# EasyEDA Pro project zdiy1.eprj, schematic Schematic1

## Sheets
1 P1: Board Name: Board1; Create Date: 2025-08-18; Page Name: P1; Project Name: zdiy1; Schematic Name: Schematic1; Update Date: 2025-09-12; Company: 嘉立创EDA; Page Size: A4; Version: V1.0
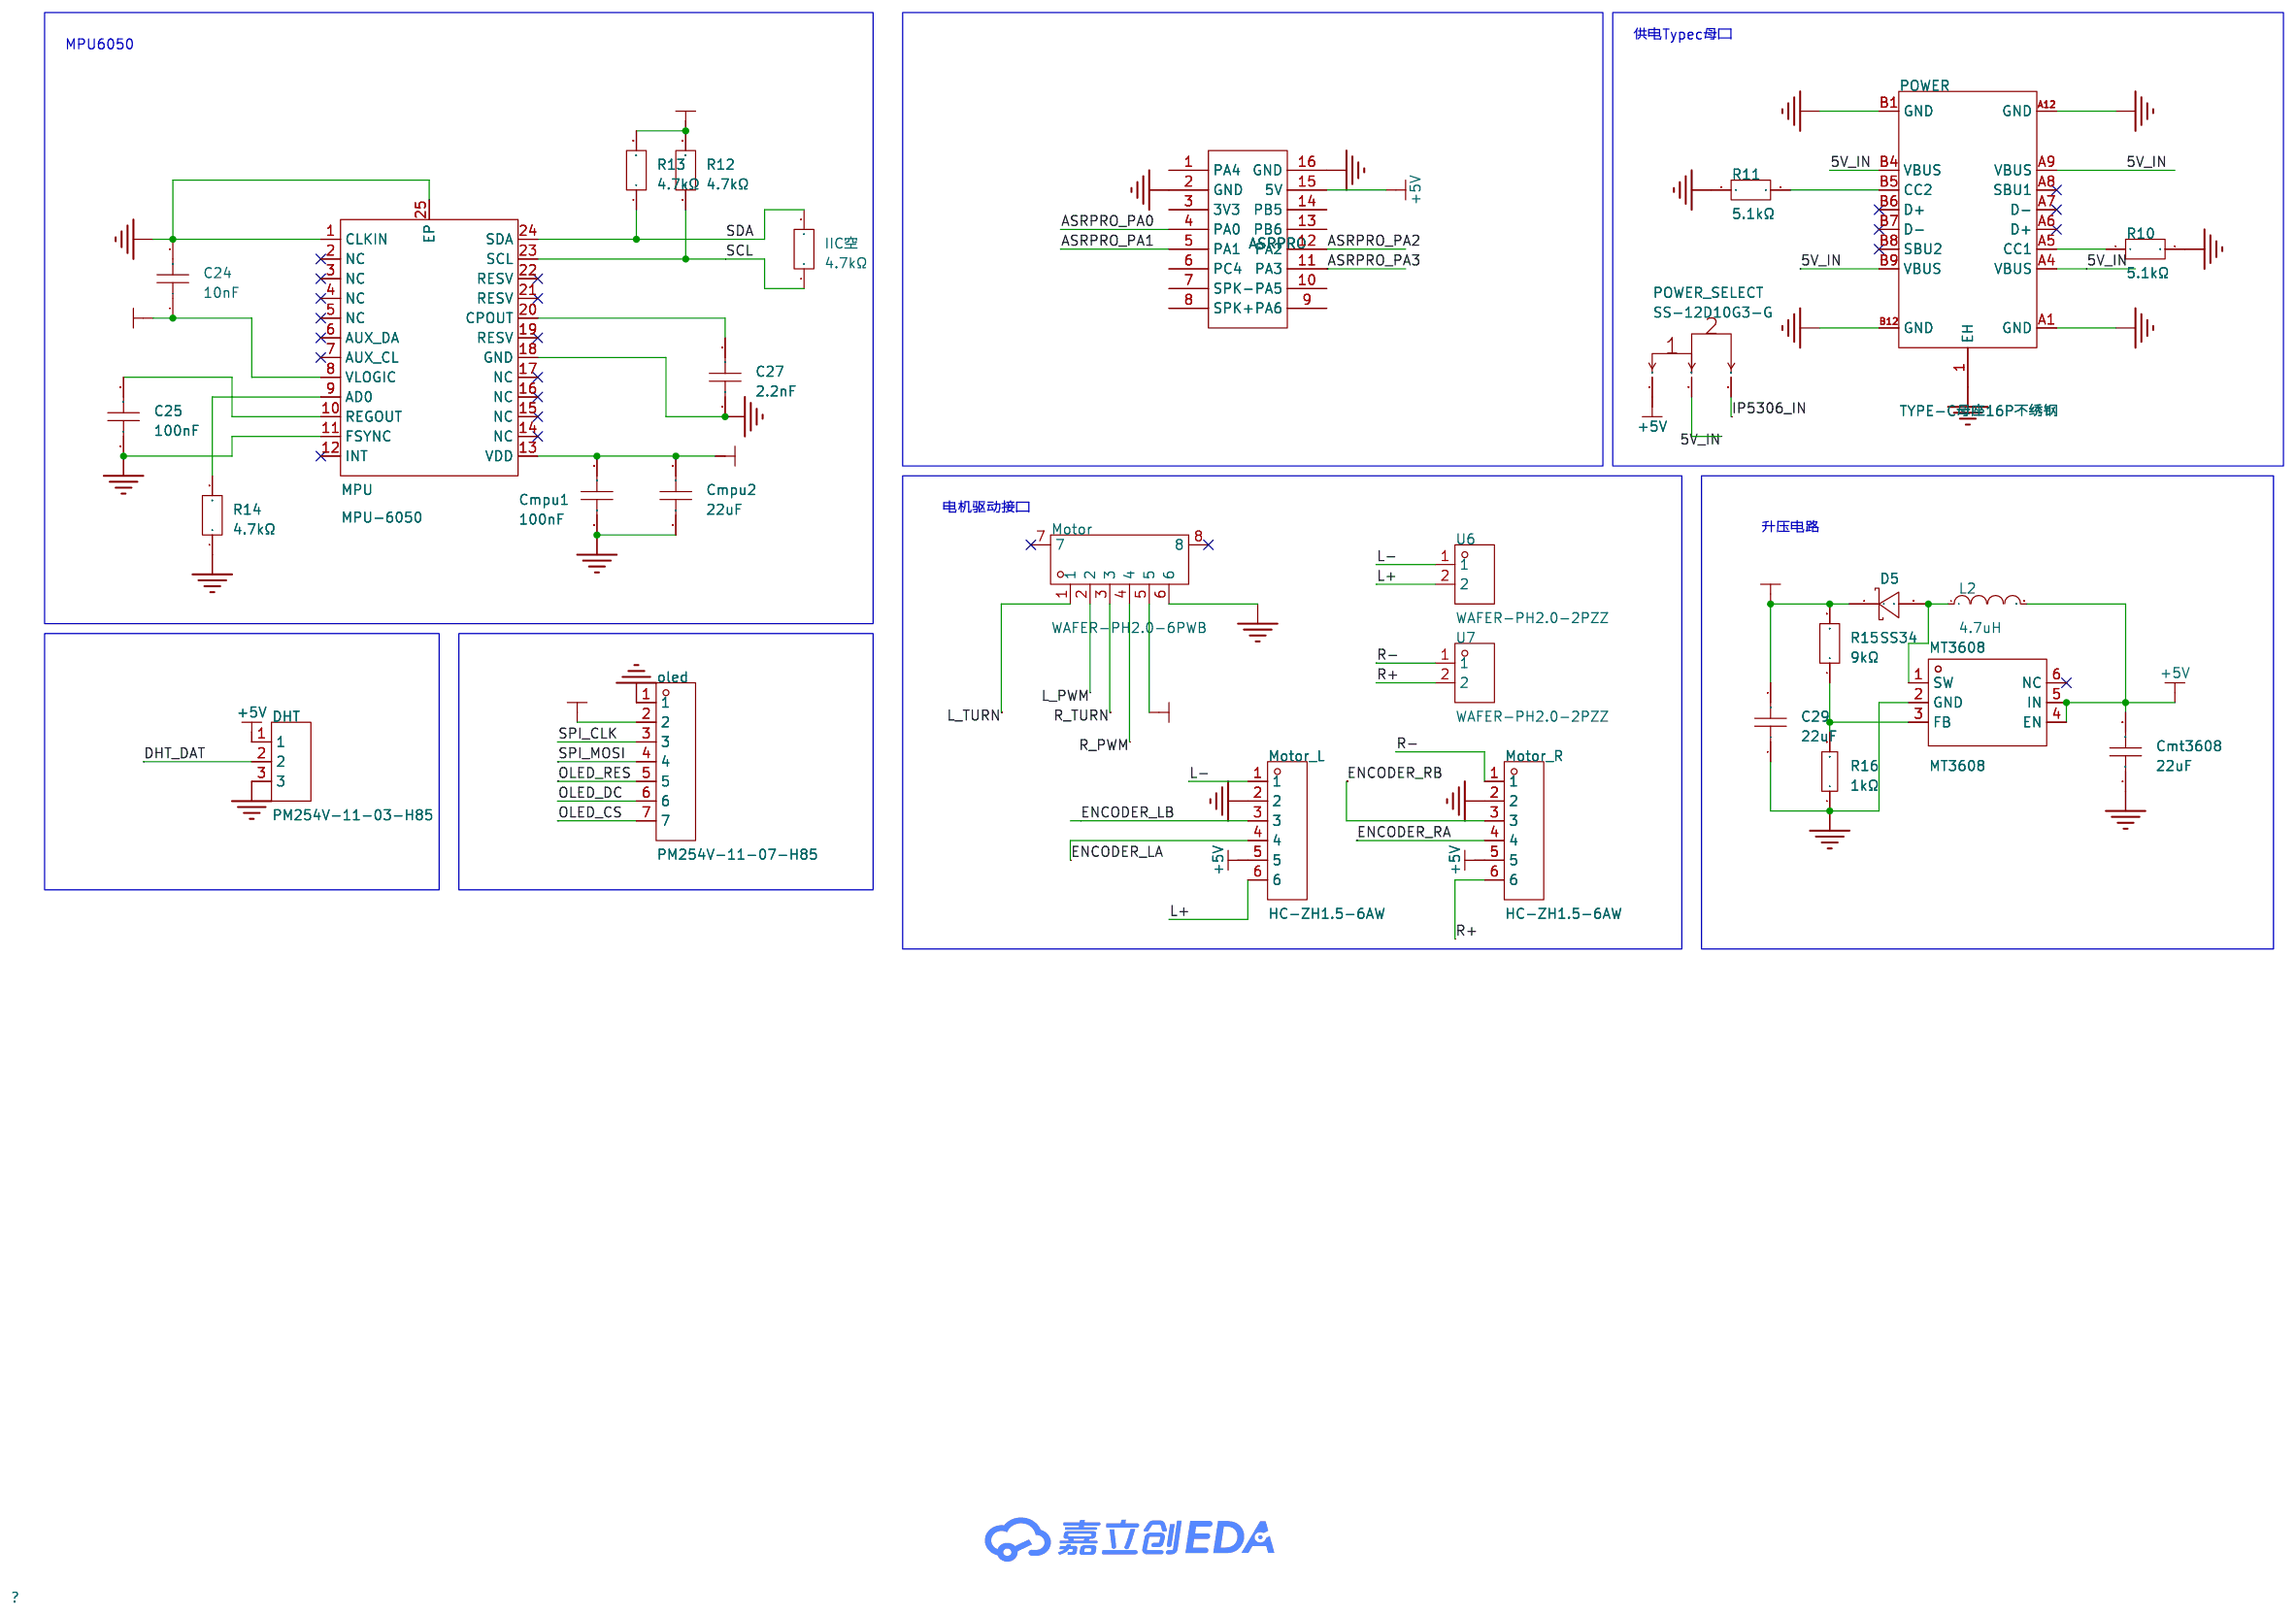
[diagram p0: P1]
2 P2: Create Date: 2025-08-19; Page Name: P2; Update Date: 2025-09-02
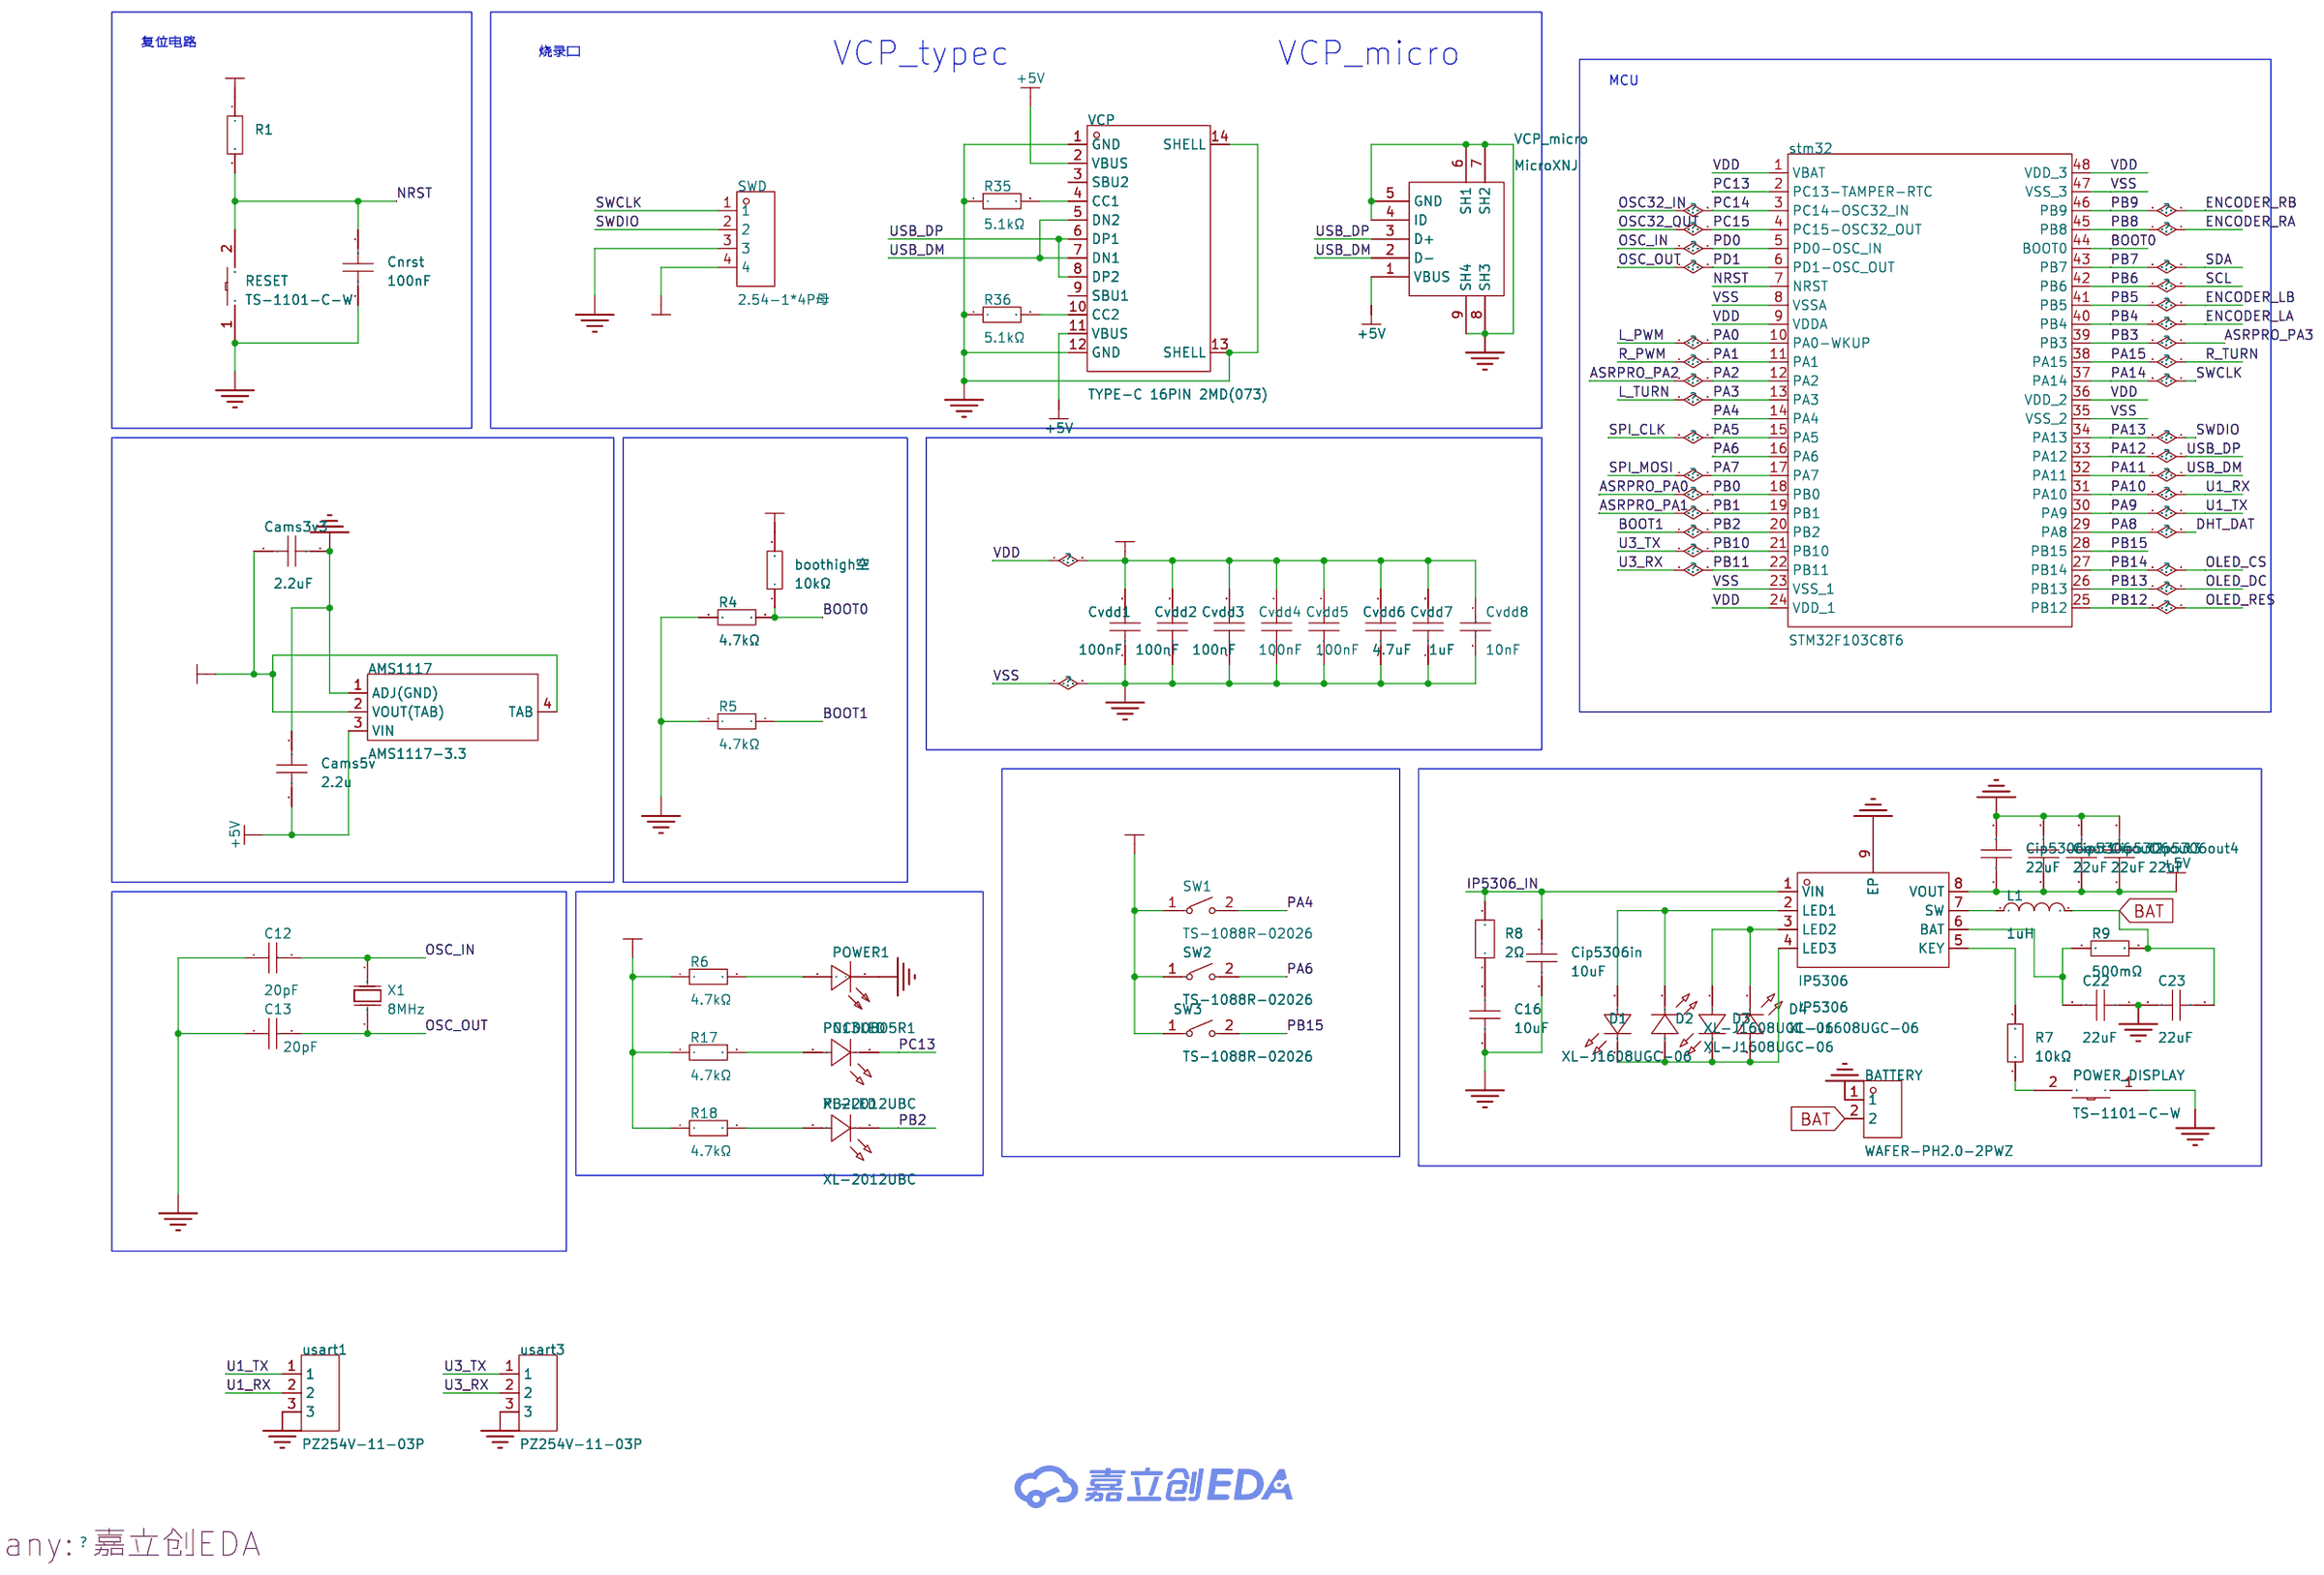
[diagram p1: P2]
3 P3: Create Date: 2025-08-30; Page Name: P3; Update Date: 2025-08-30
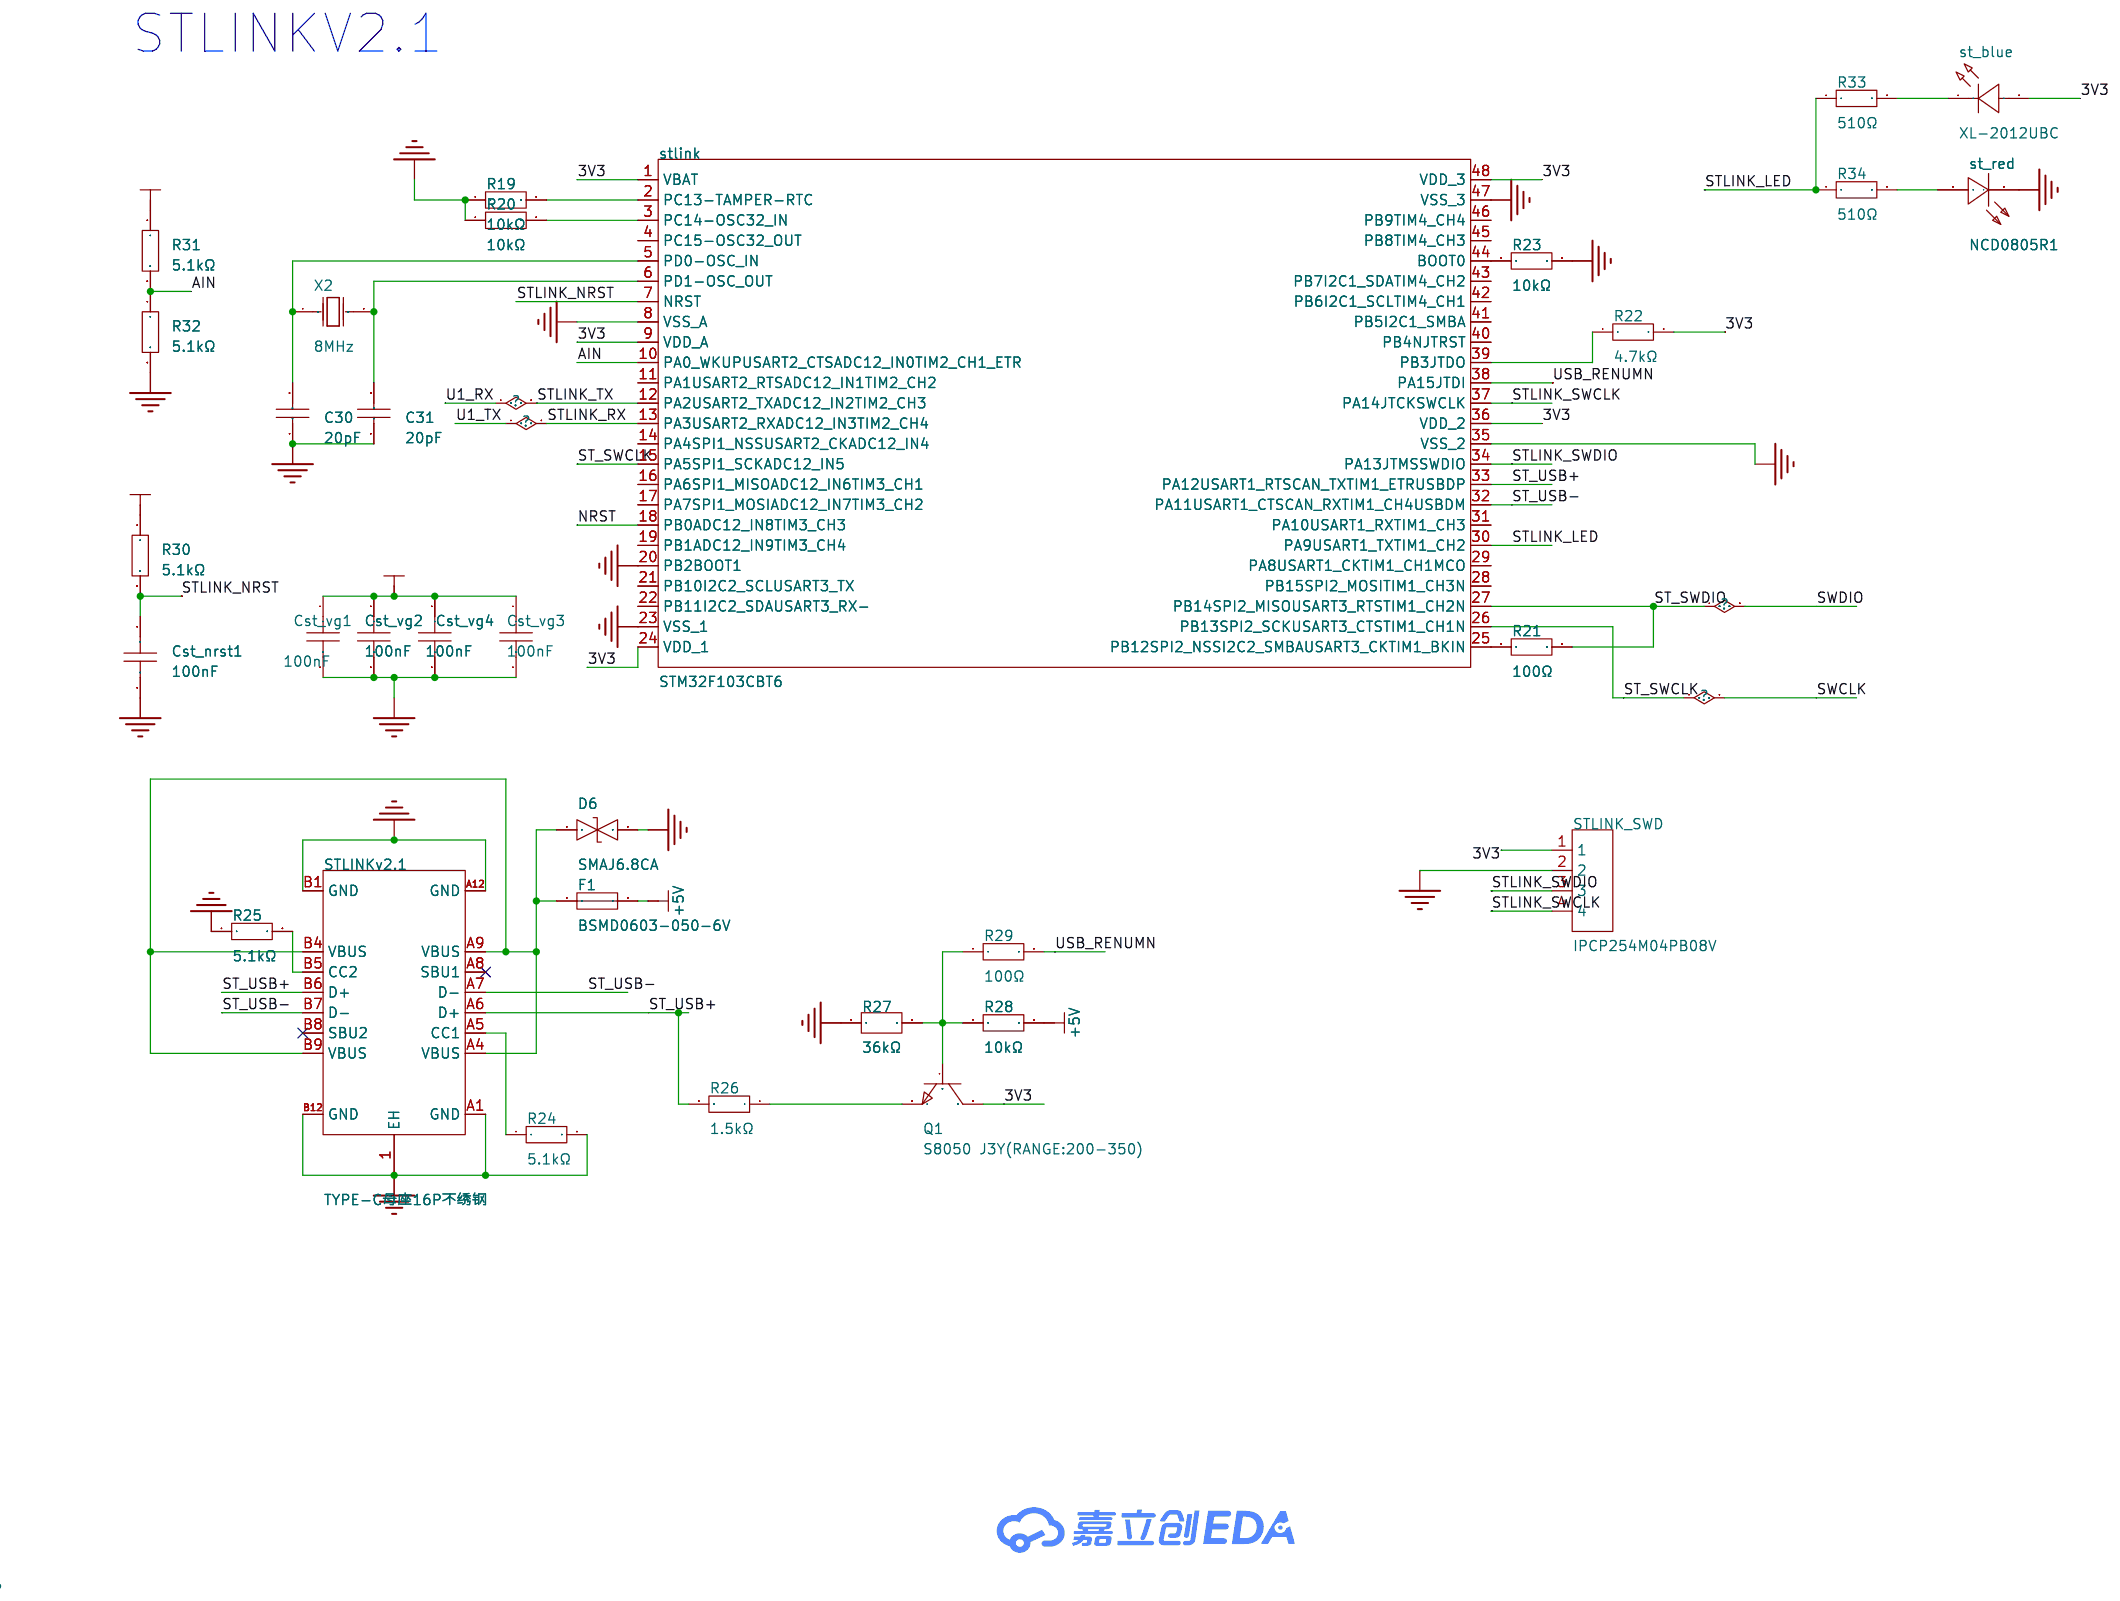
[diagram p2: P3]

## Parts
sheet P1
ASRPRO  ASRPRO  [asrpro_fz]
C24  10nF  [C0603]
C25  100nF  [C0603]
C27  2.2nF  [C0603]
C29  22uF  [C0603]
Cmpu1  100nF  [C0603]
Cmpu2  22uF  [C0603]
Cmt3608  22uF  [C0603]
D5  SS34  [SMA_L4.3-W2.6-LS5.2-RD]
DHT  PM254V-11-03-H85  [HDR-TH_3P-P2.54-V-F]
IIC空  4.7kΩ  [R0603]
L2  4.7uH  [IND-SMD_L5.4-W5.2_FXL0530]
Motor  WAFER-PH2.0-6PWB  [CONN-SMD_6P-P2.00_XUNPU_WAFER-PH2.0-6PWB]
Motor_L  HC-ZH1.5-6AW  [CONN-TH_6P-P1.50_HCTL_C-ZH1.5-6AW]
Motor_R  HC-ZH1.5-6AW  [CONN-TH_6P-P1.50_HCTL_C-ZH1.5-6AW]
MPU  MPU-6050  [QFN-24_L4.0-W4.0-P0.50-BL-EP2.7]
MT3608  MT3608  [SOT-23-6_L2.9-W1.6-P0.95-LS2.8-BL]
oled  PM254V-11-07-H85  [HDR-TH_7P-P2.54-V-F]
POWER  TYPE-C母座16P不绣钢  [TYPE-C-SMD_16P-EH4]
POWER_SELECT  SS-12D10G3-G  [SW-TH_3P-L12.7-W6.7-P4.80_SS-12D10G10-G]
R10  5.1kΩ  [R0603]
R11  5.1kΩ  [R0603]
R12  4.7kΩ  [R0603]
R13  4.7kΩ  [R0603]
R14  4.7kΩ  [R0603]
R15  9kΩ  [R0603]
R16  1kΩ  [R0603]
U6  WAFER-PH2.0-2PZZ  [CONN-TH_2P-P2.00_HC-PH-2A-M]
U7  WAFER-PH2.0-2PZZ  [CONN-TH_2P-P2.00_HC-PH-2A-M]
sheet P2
AMS1117  AMS1117-3.3  [SOT-223-4_L6.5-W3.5-P2.30-LS7.0-BR]
BATTERY  WAFER-PH2.0-2PWZ  [CONN-TH_2P-P2.00_GP01-2001WR-2P]
boothigh空  10kΩ  [R0603]
C12  20pF  [C0603]
C13  20pF  [C0603]
C16  10uF  [C0603]
C22  22uF  [C0603]
C23  22uF  [C0603]
Cams3v3  2.2uF  [C0603]
Cams5v  2.2u  [C0603]
Cip5306in  10uF  [C0603]
Cip5306out1  22uF  [C0603]
Cip5306out2  22uF  [C0603]
Cip5306out3  22uF  [C0603]
Cip5306out4  22uF  [C0603]
Cnrst  100nF  [C0603]
Cvdd1  100nF  [C0603]
Cvdd2  100nF  [C0603]
Cvdd3  100nF  [C0603]
Cvdd4  100nF  [C0603]
Cvdd5  100nF  [C0603]
Cvdd6  4.7uF  [C0603]
Cvdd7  1uF  [C0603]
Cvdd8  10nF  [C0603]
D1  XL-J1608UGC-06  [LED-SMD_XL-J1608UYC-06]
D2  XL-J1608UGC-06  [LED-SMD_XL-J1608UYC-06]
D3  XL-J1608UGC-06  [LED-SMD_XL-J1608UYC-06]
D4  XL-J1608UGC-06  [LED-SMD_XL-J1608UYC-06]
IP5306  IP5306  [ESOP-8_L4.9-W3.9-P1.27-LS6.0-BL-EP]
L1  1uH  [L0603]
PB2LED  XL-2012UBC  [LED0805-RD]
PC13LED  XL-2012UBC  [LED0805-RD]
POWER1  NCD0805R1  [LED0805-R-RD]
POWER_DISPLAY  TS-1101-C-W  [SW-SMD_L6.0-W3.3-LS8.0]
R1  5.1kΩ  [R0603]
R4  4.7kΩ  [R0603]
R5  4.7kΩ  [R0603]
R6  4.7kΩ  [R0603]
R7  10kΩ  [R0603]
R8  2Ω  [R0603]
R9  500mΩ  [R0603]
R17  4.7kΩ  [R0603]
R18  4.7kΩ  [R0603]
R35  5.1kΩ  [R0603]
R36  5.1kΩ  [R0603]
RESET  TS-1101-C-W  [SW-SMD_L6.0-W3.3-LS8.0]
stm32  STM32F103C8T6  [LQFP-48_L7.0-W7.0-P0.50-LS9.0-BL]
SW1  TS-1088R-02026  [SW-SMD_L3.9-W3.0-P4.45]
SW2  TS-1088R-02026  [SW-SMD_L3.9-W3.0-P4.45]
SW3  TS-1088R-02026  [SW-SMD_L3.9-W3.0-P4.45]
SWD  2.54-1*4P母  [HDR-TH_4P-P2.54-V-F]
usart1  PZ254V-11-03P  [HDR-TH_3P-P2.54-V-M]
usart3  PZ254V-11-03P  [HDR-TH_3P-P2.54-V-M]
VCP  TYPE-C 16PIN 2MD(073)  [USB-C-SMD_TYPE-C-6PIN-2MD-073]
VCP_micro  MicroXNJ  [MICRO-USB-SMD_MICROXNJ]
X1  8MHz  [OSC-TH_L10.0-W4.5-P5.00]
sheet P3
C30  20pF  [C0603]
C31  20pF  [C0603]
Cst_nrst1  100nF  [C0603]
Cst_vg1  100nF  [C0603]
Cst_vg2  100nF  [C0603]
Cst_vg3  100nF  [C0603]
Cst_vg4  100nF  [C0603]
D6  SMAJ6.8CA  [SMA_L4.4-W2.6-LS5.0-BI]
F1  BSMD0603-050-6V  [F0603]
Q1  S8050 J3Y(RANGE:200-350)  [SOT-23-3_L3.0-W1.7-P0.95-LS2.9-BR]
R19  10kΩ  [R0603]
R20  10kΩ  [R0603]
R21  100Ω  [R0603]
R22  4.7kΩ  [R0603]
R23  10kΩ  [R0603]
R24  5.1kΩ  [R0603]
R25  5.1kΩ  [R0603]
R26  1.5kΩ  [R0603]
R27  36kΩ  [R0603]
R28  10kΩ  [R0603]
R29  100Ω  [R0603]
R30  5.1kΩ  [R0603]
R31  5.1kΩ  [R0603]
R32  5.1kΩ  [R0603]
R33  510Ω  [R0603]
R34  510Ω  [R0603]
st_blue  XL-2012UBC  [LED0805-RD]
st_red  NCD0805R1  [LED0805-R-RD]
stlink  STM32F103CBT6  [LQFP-48_L7.0-W7.0-P0.50-LS9.0-BL]
STLINK_SWD  IPCP254M04PB08V  [HDR-TH_4P-P2.54-V-M-1]
STLINKv2.1  TYPE-C母座16P不绣钢  [TYPE-C-SMD_16P-EH4]
X2  8MHz  [OSC-TH_L10.0-W4.5-P5.00]

## Library data of the parts
ASRPRO = ASRPRO: tianwen ASRPROv2.0的倒插板封装
C24 = GRM1885C1H100GA01D: LCSC Part Name: 10pF ±2% 50V; Supplier Part: C2987939; Manufacturer: muRata(村田); Supplier Footprint: 0603; JLCPCB Part Class: 扩展库; Datasheet: https://atta.szlcsc.com/upload/public/pdf/source/20220704/6B960552DD20C01B14FA6CF85904C386.pdf; Supplier: LCSC; Tolerance: ±2%; Voltage Rating: 50V; Temperature Coefficient: C0G
C25 Cmpu1 = CGA0603C0G101J500JT: LCSC Part Name: 100pF ±5% 50V; Supplier Part: C45359929; Manufacturer: HRE(芯声); Supplier Footprint: 0603; Datasheet: https://atta.szlcsc.com/upload/public/pdf/source/20250220/F7F63959251C0C87BFE6C7B508A8A35C.pdf; Supplier: LCSC; Tolerance: ±5%; Voltage Rating: 50V; Temperature Coefficient: C0G
C27 = CGA0603X7R225K100JT: LCSC Part Name: 2.2uF ±10% 10V; Supplier Part: C23692975; Manufacturer: HRE(芯声); Supplier Footprint: 0603; JLCPCB Part Class: 扩展库; Datasheet: https://atta.szlcsc.com/upload/public/pdf/source/20240628/3505F8F72003894420BE8680067397D7.pdf; Supplier: LCSC; Tolerance: ±10%; Voltage Rating: 10V; Temperature Coefficient: X7R
C22 C23 C29 Cip5306out1-Cip5306out4 Cmpu2 Cmt3608 = CL10A226MQ8NRNC: LCSC Part Name: 22uF ±20% 6.3V; Supplier Part: C59461; Manufacturer: SAMSUNG(三星); Supplier Footprint: 0603; JLCPCB Part Class: 基础库; Datasheet: https://item.szlcsc.com/datasheet/CL10A226MQ8NRNC/60514.html; Supplier: LCSC; Tolerance: ±20%; Voltage Rating: 6.3V; Temperature Coefficient: X5R
D5 = SS34_C8678: LCSC Part Name: 电压:40V 电流:3A; Supplier Part: C8678; Manufacturer: MDD(辰达半导体); Supplier Footprint: SMA(DO-214AC); JLCPCB Part Class: 基础库; Datasheet: https://item.szlcsc.com/datasheet/SS34/9178.html; Supplier: LCSC; Diode Configuration: 独立式; Voltage - Forward(Vf@If): 550mV@3A; Voltage - DC Reverse(Vr): 40V; Current - Rectified: 3A; Reverse Leakage Current (Ir): 500uA@40V; Operating Junction Temperature Range: -55℃~+125℃
DHT = PM254V-11-03-H85: LCSC Part Name: 间距:2.54mm 1x3P 直插; Supplier Part: C541850; Manufacturer: XFCN(兴飞); Supplier Footprint: 插件,P=2.54mm; JLCPCB Part Class: 扩展库; Datasheet: https://atta.szlcsc.com/upload/public/pdf/source/20200518/C541849_85853D71FC67C51915A806977A588FDA.pdf; Supplier: LCSC; Holes Structure: 1x3P; Pitch: 2.54mm; Mounting Type: 直插; Number of Rows: 单排; Number of Holes: 3P; Contact Material: 黄铜
IIC空 R12-R14 = RCA034K7FLF: LCSC Part Name: 4.7kΩ ±1% 100mW; Supplier Part: C22369814; Manufacturer: HKR(香港电阻); Supplier Footprint: 0603; JLCPCB Part Class: 扩展库; Datasheet: https://item.szlcsc.com/datasheet/RCA034K7FLF/23848845.html; Supplier: LCSC; Tolerance: ±1%; Power(Watts): 100mW
L2 = FXL0530-4R7-M: LCSC Part Name: 4.7uH ±20% 5A; Supplier Part: C177246; Manufacturer: cjiang(长江微电); Supplier Footprint: SMD,5.2x5.4mm; JLCPCB Part Class: 扩展库; Datasheet: https://item.szlcsc.com/datasheet/FXL0530-4R7-M/188638.html; Supplier: LCSC; Tolerance: ±20%; Current Rating: 4.5A; Current - Saturation(Isat): 5A; DC Resistance(DCR): 60mΩ; Type: 一体成型电感
Motor = WAFER-PH2.0-6PWB: LCSC Part Name: 1x6P 间距:2mm 卧贴 系列:PH; Supplier Part: C3029444; Manufacturer: XUNPU(讯普); Supplier Footprint: SMD,P=2mm,卧贴; JLCPCB Part Class: 扩展库; Datasheet: https://item.szlcsc.com/datasheet/WAFER-PH2.0-6PWB/3561456.html; Supplier: LCSC; Pins Structure: 1x6P; Pitch: 2mm; Mounting Type: 卧贴; Reference Series: PH; Number of Pins: 6P; Number of Rows: 1; Number of PINs Per Row: 6; Current Rating: 2A; Contact Material: 黄铜; Operating Temperature: -25℃~+85℃; Voltage Rating: 250V; Plastic Material: LCP; Supplementary Features: 辅助焊脚; Color: 米色; Z-Height of the Board: 5.6mm; X-Length of Bottom Edge on Board (Spacing Line): 16mm; Y-Width of Bottom Edge on Board: 8.5mm
Motor_L Motor_R = HC-ZH1.5-6AW: LCSC Part Name: 1x6P 间距:1.5mm 弯插 系列:ZH; Supplier Part: C2845569; Manufacturer: HCTL(华灿天禄); Supplier Footprint: 弯插,P=1.5mm; JLCPCB Part Class: 扩展库; Datasheet: https://item.szlcsc.com/datasheet/HC-ZH1.5-6AW/3039250.html; Supplier: LCSC; Pins Structure: 1x6P; Pitch: 1.5mm; Mounting Type: 弯插; Reference Series: ZH; Number of Pins: 6P; Number of Rows: 1; Number of PINs Per Row: 6; Current Rating: 1A; Contact Material: 黄铜; Contact Plating: 锡; Operating Temperature: -25℃~+85℃; Voltage Rating: 100V; Plastic Material: PBT; Flame Retardant Rating: UL94V-0; Supplementary Features: 打K脚; Z-Height of the Board: 3.7mm; X-Length of Bottom Edge on Board (Spacing Line): 10.5mm
MPU = MPU-6050: Supplier Part: C24112; Manufacturer: TDK InvenSense(应美盛); Supplier Footprint: QFN-24-EP(4x4); JLCPCB Part Class: 扩展库; Datasheet: https://atta.szlcsc.com/upload/public/pdf/source/20140425/1457707046159.pdf; Supplier: LCSC; Sensor Type: 加速度计陀螺仪; Operating Temperature: -40℃~+85℃
MT3608 = MT3608: LCSC Part Name: 老版本 高效1.2MHz 2A升压转换器; Supplier Part: C84817; Manufacturer: 西安航天民芯; Supplier Footprint: SOT-23-6; JLCPCB Part Class: 扩展库; Datasheet: https://item.szlcsc.com/datasheet/MT3608/85988.html; Supplier: LCSC; Function: 升压型; Output Type: 可调; Voltage - Supply: 2V~24V; Output Current: 2A; Frequency - Switching: 1.2MHz; Operating Temperature: -40℃~+85℃; Synchronous Rectifier: 否; Number of Outputs: 1; Topology: 升压式; Quiescent Current: 100uA；1.6mA; Switch tube (built-in/external): 内置
oled = PM254V-11-07-H85: LCSC Part Name: 间距:2.54mm 1x7P 直插; Supplier Part: C2832270; Manufacturer: XFCN(兴飞); Supplier Footprint: 插件,P=2.54mm; JLCPCB Part Class: 扩展库; Datasheet: https://atta.szlcsc.com/upload/public/pdf/source/20210514/C2832270_F424CC0071A81298BFB56B53406F9842.pdf; Supplier: LCSC; Holes Structure: 1x7P; Pitch: 2.54mm; Circular Hole / Square Hole: 方孔; Mounting Type: 直插; Number of Rows: 单排; Number of Holes: 7P; Current Rating (Max): 3A; Voltage Rating (Max): 250V; Holes Direction: 顶部; Operating Temperature Range: -40℃~+105℃
POWER STLINKv2.1 = TYPE-C母座16P不绣钢: Supplier Part: C9900003726; Supplier Footprint: TYPE-C-SMD_16P-L8.94-W7.35-P0.50; JLCPCB Part Class: 扩展库; Supplier: LCSC
POWER_SELECT = SS-12D10G3-G: LCSC Part Name: 拨动开关,立式直脚两档,插件,单排正拨,柄长3mm; Supplier Part: C49284729; Manufacturer: XUNPU(讯普); Supplier Footprint: 插件; JLCPCB Part Class: 扩展库; Datasheet: https://item.szlcsc.com/datasheet/SS-12D10G3-G/51736278.html; Supplier: LCSC
R10 R11 = RT0603BRB075K1L: LCSC Part Name: 薄膜电阻 5.1kΩ ±0.1% 100mW; Supplier Part: C860455; Manufacturer: YAGEO(国巨); Supplier Footprint: 0603; JLCPCB Part Class: 扩展库; Datasheet: https://atta.szlcsc.com/upload/public/pdf/source/20200610/C326738_5639A9F1B6EB6E4AE2197577D3456E7F.pdf; Supplier: LCSC; Type: 薄膜电阻; Tolerance: ±0.1%; Power(Watts): 100mW; Temperature Coefficient: ±10ppm/℃; Operating Temperature: -55℃~+155℃
R15 = FRC0603F9001TS: LCSC Part Name: 9kΩ ±1% 100mW 厚膜电阻; Supplier Part: C2998085; Manufacturer: FOJAN(富捷); Supplier Footprint: 0603; JLCPCB Part Class: 扩展库; Datasheet: https://item.szlcsc.com/datasheet/FRC0603F9001TS/3471443.html; Supplier: LCSC; Type: 厚膜电阻; Tolerance: ±1%; Power(Watts): 100mW; Voltage-Supply(Max): 75V; Temperature Coefficient: ±100ppm/℃; Operating Temperature: -55℃~+155℃
R16 = 0603WAF1001T5E: LCSC Part Name: 1kΩ ±1% 100mW 厚膜电阻; Supplier Part: C21190; Manufacturer: UNI-ROYAL(厚声); Supplier Footprint: 0603; JLCPCB Part Class: 基础库; Datasheet: https://atta.szlcsc.com/upload/public/pdf/source/20200306/C422600_1E6D84923E4A46A82E41ADD87F860B5C.pdf; Supplier: LCSC; Type: 厚膜电阻; Tolerance: ±1%; Power(Watts): 100mW; Overload Voltage (Max): 75V; Temperature Coefficient: ±100ppm/℃; Operating Temperature Range: -55℃~+155℃
U6 U7 = WAFER-PH2.0-2PZZ: LCSC Part Name: 1x2P 间距:2mm 直插 系列:PH; Supplier Part: C5359599; Manufacturer: XUNPU(讯普); Supplier Footprint: 插件,P=2mm; JLCPCB Part Class: 扩展库; Datasheet: https://atta.szlcsc.com/upload/public/pdf/source/20241108/09B74E94153224768C62B7F095CB8C18.pdf; Supplier: LCSC; Pins Structure: 1x2P; Pitch: 2mm; Mounting Type: 直插; Reference Series: PH; Number of Pins: 2P; Number of Rows: 1; Number of PINs Per Row: 2; Current Rating: 2A; Contact Material: 黄铜; Contact Plating: 锡; Operating Temperature: -25℃~+85℃; Voltage Rating: 250V; Plastic Material: PA66; Flame Retardant Rating: UL94V-0; Color: 白色; Z-Height of the Board: 6.05mm; X-Length of Bottom Edge on Board (Spacing Line): 6mm; Y-Width of Bottom Edge on Board: 4.7mm
AMS1117 = AMS1117-3.3_C347222: LCSC Part Name: 输出:3.3V 电流:1A 耐压:12V; Supplier Part: C347222; Manufacturer: UMW(友台半导体); Supplier Footprint: SOT-223; JLCPCB Part Class: 扩展库; Datasheet: https://item.szlcsc.com/datasheet/AMS1117-3.3/323882.html; Supplier: LCSC; Output Type: 固定; Voltage - Supply: 12V; Output Voltage: 3.3V; Output Current: 1A; Power Supply Rejection Ratio (PSRR): 60dB@(120Hz); Voltage Dropout: 1.3V@(1A); Features: 过流保护; Output Configuration: 正极; Number of Outputs: 1
BATTERY = WAFER-PH2.0-2PWZ: LCSC Part Name: 1x2P 间距:2mm 弯插 系列:PH; Supplier Part: C5359610; Manufacturer: XUNPU(讯普); Supplier Footprint: 弯插,P=2mm; JLCPCB Part Class: 扩展库; Datasheet: https://item.szlcsc.com/datasheet/WAFER-PH2.0-2PWZ/6173846.html; Supplier: LCSC; Pins Structure: 1x2P; Pitch: 2mm; Mounting Type: 弯插; Reference Series: PH; Number of Pins: 2P; Number of Rows: 1; Number of PINs Per Row: 2; Current Rating: 2A; Contact Material: 黄铜; Contact Plating: 锡; Operating Temperature: -25℃~+85℃; Voltage Rating: 250V; Plastic Material: PA66; Flame Retardant Rating: UL94V-0; Color: 白色; Z-Height of the Board: 4.7mm; X-Length of Bottom Edge on Board (Spacing Line): 6mm; Y-Width of Bottom Edge on Board: 6.05mm
boothigh空 R7 R19 R20 R23 R28 = 0603WAF1002T5E: LCSC Part Name: 厚膜电阻 10kΩ ±1% 100mW; Supplier Part: C25804; Manufacturer: UNI-ROYAL(厚声); Supplier Footprint: 0603; JLCPCB Part Class: 基础库; Datasheet: https://item.szlcsc.com/datasheet/0603WAF1002T5E/26547.html; Supplier: LCSC; Type: 厚膜电阻; Tolerance: ±1%; Power(Watts): 100mW; Voltage-Supply(Max): 75V; Temperature Coefficient: ±100ppm/℃; Operating Temperature: -55℃~+155℃
C12 C13 C30 C31 = CC0603JRNPO9BN200: LCSC Part Name: 20pF ±5% 50V; Supplier Part: C105621; Manufacturer: YAGEO(国巨); Supplier Footprint: 0603; JLCPCB Part Class: 扩展库; Datasheet: https://atta.szlcsc.com/upload/public/pdf/source/20170505/1493957838062.pdf; Supplier: LCSC; Tolerance: ±5%; Voltage Rated: 50V; Temperature Coefficient: NP0
C16 Cip5306in = CL10A106KP8NNNC: LCSC Part Name: 10uF ±10% 10V; Supplier Part: C19702; Manufacturer: SAMSUNG(三星); Supplier Footprint: 0603; JLCPCB Part Class: 基础库; Datasheet: https://item.szlcsc.com/datasheet/CL10A106KP8NNNC/20411.html; Supplier: LCSC; Tolerance: ±10%; Voltage Rating: 10V; Temperature Coefficient: X5R
Cams3v3 Cams5v = CGA0603X7R104K500JT: LCSC Part Name: 100nF ±10% 50V; Supplier Part: C6119867; Manufacturer: HRE(芯声); Supplier Footprint: 0603; JLCPCB Part Class: 扩展库; Datasheet: https://atta.szlcsc.com/upload/public/pdf/source/20250103/C44077DA9E7B3EFAE02F22B6D3D1CBC9.pdf; Supplier: LCSC; Tolerance: ±10%; Voltage Rating: 50V; Temperature Coefficient: X7R
Cnrst Cst_nrst1 Cst_vg1-Cst_vg4 Cvdd1-Cvdd5 = CC0603KRX7R9BB104: LCSC Part Name: 100nF ±10% 50V; Supplier Part: C14663; Manufacturer: YAGEO(国巨); Supplier Footprint: 0603; JLCPCB Part Class: 基础库; Datasheet: https://atta.szlcsc.com/upload/public/pdf/source/20250214/096C4C206003071F5D32E5F0D8E7F8DF.pdf; Supplier: LCSC; Tolerance: ±10%; Voltage Rating: 50V; Temperature Coefficient: X7R
Cvdd6 = CL10A475KO8NNNC: LCSC Part Name: 4.7uF ±10% 16V; Supplier Part: C19666; Manufacturer: SAMSUNG(三星); Supplier Footprint: 0603; JLCPCB Part Class: 基础库; Datasheet: https://item.szlcsc.com/datasheet/CL10A475KO8NNNC/20375.html; Supplier: LCSC; Tolerance: ±10%; Voltage Rating: 16V; Temperature Coefficient: X5R
Cvdd7 = CL10A105KB8NNNC: LCSC Part Name: 1uF ±10% 50V; Supplier Part: C15849; Manufacturer: SAMSUNG(三星); Supplier Footprint: 0603; JLCPCB Part Class: 基础库; Datasheet: https://item.szlcsc.com/datasheet/CL10A105KB8NNNC/16531.html; Supplier: LCSC; Tolerance: ±10%; Voltage Rating: 50V; Temperature Coefficient: X5R
Cvdd8 = CC0603KRX7R9BB103: LCSC Part Name: 10nF ±10% 50V; Supplier Part: C100042; Manufacturer: YAGEO(国巨); Supplier Footprint: 0603; JLCPCB Part Class: 扩展库; Datasheet: https://atta.szlcsc.com/upload/public/pdf/source/20181008/C309510_22F155564471FAF6A489F7D68F34234E.pdf; Supplier: LCSC; Tolerance: ±10%; Voltage Rated: 50V; Temperature Coefficient: X7R
D1-D4 = XL-J1608UGC-06: LCSC Part Name: 0603翠绿0.6T（金版）; Supplier Part: C48586668; Manufacturer: XINGLIGHT(成兴光); Supplier Footprint: SMD; JLCPCB Part Class: 扩展库; Datasheet: https://atta.szlcsc.com/upload/public/pdf/source/20250424/385BDB5A154828C5085379BCE10F308E.pdf; Supplier: LCSC; Illumination Color: 绿色; Voltage - Forward(Vf): 2.5V~3V; Power(Watts): 75mW; Forward Current: 20mA; Wavelength - Dominant: 515nm~530nm; Peak Wavelength: 525nm; Lens Color: 无色透明透镜; Luminous Intensity: 600mcd~1000mcd; Viewing Angle: 120°; Operating Temperature: -40℃~+85℃
IP5306 = IP5306: Supplier Part: C181692; Manufacturer: INJOINIC(英集芯); Supplier Footprint: ESOP-8; JLCPCB Part Class: 扩展库; Datasheet: https://item.szlcsc.com/datasheet/IP5306/193089.html; Supplier: LCSC; Voltage - Supply: 4.65V~5.5V; Charging Saturation Voltage: 4.2V; Number of Cells: 1; Operating Temperature: 0℃~+70℃
L1 = AHW1608F-1R0KTF: LCSC Part Name: 1uH ±10% 公制尺寸:1608; Supplier Part: C6364703; Manufacturer: APV(爱普微); Supplier Footprint: 0603; JLCPCB Part Class: 扩展库; Datasheet: https://atta.szlcsc.com/upload/public/pdf/source/20230523/E53ED9368637CE3FE1F67F3D75587EF6.pdf; Supplier: LCSC; Tolerance: ±10%; Current Rating: 330mA; DC Resistance(DCR): 810mΩ; Q @ Frequency: 12; Frequency - Self Resonant: 400MHz; Type: 绕线片式电感
PB2LED PC13LED st_blue = XL-2012UBC: Supplier Part: C965817; Manufacturer: XINGLIGHT(成兴光); Supplier Footprint: 0805; JLCPCB Part Class: 扩展库; Datasheet: https://item.szlcsc.com/datasheet/XL-2012UBC/1051426.html; Supplier: LCSC; Illumination Color: 蓝色; Voltage - Forward(Vf): 3.2V; Power(Watts): 70mW; Forward Current: 20mA; Wavelength - Dominant: 460nm~475nm; Peak Wavelength: 470nm; Lens Color: 无色透明透镜; Luminous Intensity: 260mcd; Viewing Angle: 120°; Mounting Style: 正贴
POWER1 st_red = NCD0805R1: Supplier Part: C84256; Manufacturer: 国星光电; Supplier Footprint: 0805; JLCPCB Part Class: 基础库; Datasheet: https://atta.szlcsc.com/upload/public/pdf/source/20200820/C84256_F0A75A43B3EAD75808600A0514C76B99.pdf; Supplier: LCSC; Emitted Color: 红色; Forward Voltage (VF): 1.6V~2.6V; Power Dissipation: 65mW; Forward Current: 20mA; Dominant Wavelength: 615nm~630nm; Diode Configuration: 独立二极管; Lens Color: 无色透明透镜; Luminous Intensity: 67mcd~195mcd; Viewing Angle: 130°; Operating Temperature: -30℃~+85℃
POWER_DISPLAY RESET = TS-1101-C-W: LCSC Part Name: 6*3.6*2.5mm 立贴 轻触开关; Supplier Part: C318938; Manufacturer: XKB Connectivity(中国星坤); Supplier Footprint: SMD; JLCPCB Part Class: 扩展库; Datasheet: https://atta.szlcsc.com/upload/public/pdf/source/20200227/C318938_C2E53B1EEDE37D980A33616AC086DE53.pdf; Supplier: LCSC; Circuit: 单刀单掷; Actuator Style: 矩形按钮; Operating Force: 260gf; Mounting Style: 立贴; Switch Length: 6mm; Switch Width: 3.6mm; Switch Height: 2.5mm; Strike Gundam: 不带; Contact Current: 50mA; Voltage Rating (DC): 12V; Actuator/Cap Color: 白色带淡绿; With Lamp: 无; Mechanical Life: 5万次; Operating Temperature: -30℃~+85℃
R1 R24 R25 R30-R32 R35 R36 = 0603WAF5101T5E: LCSC Part Name: 5.1kΩ ±1% 100mW 厚膜电阻; Supplier Part: C23186; Manufacturer: UNI-ROYAL(厚声); Supplier Footprint: 0603; JLCPCB Part Class: 基础库; Datasheet: https://item.szlcsc.com/datasheet/0603WAF5101T5E/23913.html; Supplier: LCSC; Type: 厚膜电阻; Tolerance: ±1%; Power(Watts): 100mW; Voltage-Supply(Max): 75V; Temperature Coefficient: ±100ppm/℃; Operating Temperature: -55℃~+155℃
R4-R6 R17 R18 R22 = 0603WAF4701T5E: LCSC Part Name: 4.7kΩ ±1% 100mW 厚膜电阻; Supplier Part: C23162; Manufacturer: UNI-ROYAL(厚声); Supplier Footprint: 0603; JLCPCB Part Class: 基础库; Datasheet: https://item.szlcsc.com/datasheet/0603WAF4701T5E/23889.html; Supplier: LCSC; Type: 厚膜电阻; Tolerance: ±1%; Power(Watts): 100mW; Voltage-Supply(Max): 75V; Temperature Coefficient: ±100ppm/℃; Operating Temperature: -55℃~+155℃
R8 = FRC0603J2R0 TS: LCSC Part Name: 2Ω ±5% 100mW 厚膜电阻; Supplier Part: C2907139; Manufacturer: FOJAN(富捷); Supplier Footprint: 0603; JLCPCB Part Class: 扩展库; Datasheet: https://item.szlcsc.com/datasheet/FRC0603J2R0%2520TS/3180652.html; Supplier: LCSC; Type: 厚膜电阻; Tolerance: ±5%; Power(Watts): 100mW; Voltage-Supply(Max): 75V; Temperature Coefficient: ±200ppm/℃; Operating Temperature: -55℃~+155℃
R9 = 0603WAF500LT5E: LCSC Part Name: 500mΩ ±1% 100mW 厚膜电阻; Supplier Part: C45312; Manufacturer: UNI-ROYAL(厚声); Supplier Footprint: 0603; JLCPCB Part Class: 扩展库; Datasheet: https://item.szlcsc.com/datasheet/0603WAF500LT5E/46314.html; Supplier: LCSC; Type: 厚膜电阻; Tolerance: ±1%; Power(Watts): 100mW; Voltage-Supply(Max): 75V; Temperature Coefficient: ±800ppm/℃; Operating Temperature: -55℃~+155℃
stm32 = STM32F103C8T6: LCSC Part Name: 主流增强型ARM Cortex-M3 MCU，具有64 KB Flash、72 MHz CPU、电机控制、USB和CAN; Supplier Part: C8734; Manufacturer: ST(意法半导体); Supplier Footprint: LQFP-48(7x7); JLCPCB Part Class: 扩展库; Datasheet: https://item.szlcsc.com/datasheet/STM32F103C8T6/9243.html; Supplier: LCSC; CPU Core: ARM-M3; CPU Maximum Speed: 72MHz; Program Storage Size: 64KB; Program Memory Type: FLASH; Number of I/O: 37; ADC (Bit): 12bit; Voltage - Supply: 2V~3.6V
SW1-SW3 = TS-1088R-02026: LCSC Part Name: 3.9*2.93*2mm 立贴 轻触开关; Supplier Part: C455280; Manufacturer: XUNPU(讯普); Supplier Footprint: SMD,3x4mm; JLCPCB Part Class: 扩展库; Datasheet: https://item.szlcsc.com/datasheet/TS-1088R-02026/457635.html; Supplier: LCSC; Circuit: 单刀单掷; Actuator Style: 圆形按钮; Mounting Type: 立贴; Length: 3.9mm; Width: 2.93mm; Switch Height: 2mm; Contact Current: 50mA; Voltage Rating: 12V
SWD = 2.54-1*4P母: LCSC Part Name: 间距:2.54mm 1x4P 直插; Supplier Part: C2718488; Manufacturer: BOOMELE(博穆精密); Supplier Footprint: 插件,P=2.54mm; JLCPCB Part Class: 扩展库; Datasheet: https://atta.szlcsc.com/upload/public/pdf/source/20210301/C2718488_F4427B881E42CAA8DDB0B1C12B3A522C.pdf; Supplier: LCSC; Holes Structure: 1x4P; Pitch: 2.54mm; Circular Hole / Square Hole: 方孔; Mounting Type: 直插; Number of Rows: 单排; Number of Holes: 4P; Current Rating (Max): 3A; Holes Direction: 顶部; Contact Material: 青铜; Operating Temperature Range: -40℃~+105℃
usart1 usart3 = PZ254V-11-03P: LCSC Part Name: 1x3P 间距:2.54mm 方针 直插; Supplier Part: C2937625; Manufacturer: XFCN(兴飞); Supplier Footprint: 插件,P=2.54mm; JLCPCB Part Class: 扩展库; Datasheet: https://item.szlcsc.com/datasheet/PZ254V-11-03P/3293280.html; Supplier: LCSC; Pin Structure: 1x3P; Pitch: 2.54mm; Circluar Pins/Square Pins: 方针; Mounting Type: 直插; Number of Rows: 单排; Number of Pins: 3P; Current Rating: 3A; Voltage Rating (Max): 250V; Length of Mating Pin: 6mm; Insulation Height: 2.5mm; Length of End Connection Pin: 3mm; Operating Temperature: -40℃~+105℃; Color: 黑色
VCP = TYPE-C 16PIN 2MD(073): LCSC Part Name: Type-C 母 卧贴; Supplier Part: C2765186; Manufacturer: SHOU HAN(首韩); Supplier Footprint: SMD; JLCPCB Part Class: 扩展库; Datasheet: https://item.szlcsc.com/datasheet/TYPE-C%252016PIN%25202MD(073)/2901843.html; Supplier: LCSC; Connector Type: Type-C; Protocol Standard: USB 3.1; Gender: 母; Mounting Type: 卧贴; Number of Contacts: 16P; Number of Ports: 1; Current Rating-Power: 3A; Voltage Rating: 5V; Connect-Disconnect Life: 5千次; Detection color: 黑色; Operating Temperature: -25℃~+85℃
VCP_micro = MicroXNJ: LCSC Part Name: Micro-B 母 卧贴; Supplier Part: C404969; Manufacturer: SHOU HAN(首韩); Supplier Footprint: SMD; JLCPCB Part Class: 扩展库; Datasheet: https://item.szlcsc.com/datasheet/MicroXNJ/392534.html; Supplier: LCSC; Connector Type: Micro-B; Protocol Standard: USB 2.0; Gender: 母; Mounting Type: 卧贴; Number of Contacts: 5P; Number of Ports: 1; Current Rating-Power: 1.8A; Voltage Rating: 30V; Connect-Disconnect Life: 5千次; Detection color: 黑色; Operating Temperature: -20℃~+85℃
X1 X2 = X49SD8MSD2SC: LCSC Part Name: HC-49US 8MHZ 2P 49S 20PF ±20PPM -20~70℃ (±30PPM); Supplier Part: C21263; Manufacturer: YXC(扬兴晶振); Supplier Footprint: HC-49S; JLCPCB Part Class: 扩展库; Datasheet: https://atta.szlcsc.com/upload/public/pdf/source/20240329/977D7F2434F98B2BE33270BB9FF3D86D.pdf; Supplier: LCSC; Type: 直插晶振; Normal temperature Frequency Tolerance: ±20ppm; Load Capacitance: 20pF; Frequency Stability: ±30ppm; Operating Temperature: -20℃~+70℃
D6 = SMAJ6.8CA_C406209: LCSC Part Name: 双向TVS 5.8V截止 峰值脉冲电流：39.5A@10/1000us; Supplier Part: C406209; Manufacturer: BORN(伯恩半导体); Supplier Footprint: SMA(DO-214AC); JLCPCB Part Class: 扩展库; Datasheet: https://item.szlcsc.com/datasheet/SMAJ6.8CA/393972.html; Supplier: LCSC; Polarity: 双向; Reverse Stand-Off Voltage (Vrwm): 5.8V; Clamping Voltage: 10.5V; Peak Pulse Current (Ipp): 39.5A@10/1000us; Peak Pulse Power Dissipation (Ppp): 400W@10/1000us; Voltage - Breakdown: 7.14V; Reverse Leakage Current (Ir): 500uA; level of protection: IEC 61000-4-2；IEC 61000-4-4; Type: TVS
F1 = BSMD0603-050-6V: LCSC Part Name: 6V 500mA 0603自恢复; Supplier Part: C883095; Manufacturer: BHFUSE(佰宏); Supplier Footprint: 0603; JLCPCB Part Class: 扩展库; Datasheet: https://item.szlcsc.com/datasheet/BSMD0603-050-6V/947770.html; Supplier: LCSC; Voltage - Max: 6V; Current - Max: 40A; Hold Current: 500mA; Trip Current: 1A; Power Dissipation: 500mW; Resistance - Initial (Ri) (Min): 100mΩ; Resistance - Post Trip (R1) (Max): 800mΩ; Operating Temperature: -40℃~+85℃; Length: 1.85mm; Width: 1.05mm; Height: 1.15mm
Q1 = S8050 J3Y(RANGE:200-350): LCSC Part Name: H档(200-350) NPN 电流:0.5A 电压:25V; Supplier Part: C2146; Manufacturer: CJ(江苏长电/长晶); Supplier Footprint: SOT-23; JLCPCB Part Class: 基础库; Datasheet: https://item.szlcsc.com/datasheet/S8050%2520J3Y(RANGE%253A200-350)/2503.html; Supplier: LCSC; type: NPN; Current - Collector(Ic): 500mA; Collector - Emitter Voltage VCEO: 25V; Pd - Power Dissipation: 300mW; DC Current Gain: 200@500mA,1V; Transition frequency(fT): 150MHz; Current - Collector Cutoff: 100nA; Vce Saturation(VCE(sat)): 600mV@500mA,50mA; Operating Temperature: -55℃~+150℃; Emitter-Base Voltage(Vebo): 5V; Number: 1个NPN
R21 R29 = 0603WAF1000T5E: LCSC Part Name: 100Ω ±1% 100mW 厚膜电阻; Supplier Part: C22775; Manufacturer: UNI-ROYAL(厚声); Supplier Footprint: 0603; JLCPCB Part Class: 基础库; Datasheet: https://atta.szlcsc.com/upload/public/pdf/source/20200306/C422600_1E6D84923E4A46A82E41ADD87F860B5C.pdf; Supplier: LCSC; Type: 厚膜电阻; Tolerance: ±1%; Power(Watts): 100mW; Overload Voltage (Max): 75V; Temperature Coefficient: ±200ppm/℃; Operating Temperature Range: -55℃~+155℃
R26 = 0603WAF1501T5E: LCSC Part Name: 1.5kΩ ±1% 100mW 厚膜电阻; Supplier Part: C22843; Manufacturer: UNI-ROYAL(厚声); Supplier Footprint: 0603; JLCPCB Part Class: 基础库; Datasheet: https://item.szlcsc.com/datasheet/0603WAF1501T5E/23570.html; Supplier: LCSC; Type: 厚膜电阻; Tolerance: ±1%; Power(Watts): 100mW; Voltage-Supply(Max): 75V; Temperature Coefficient: ±100ppm/℃; Operating Temperature: -55℃~+155℃
R27 = FRC0603F3602TS: LCSC Part Name: 36kΩ ±1% 100mW 厚膜电阻; Supplier Part: C2930097; Manufacturer: FOJAN(富捷); Supplier Footprint: 0603; JLCPCB Part Class: 扩展库; Datasheet: https://item.szlcsc.com/datasheet/FRC0603F3602TS/3267030.html; Supplier: LCSC; Type: 厚膜电阻; Tolerance: ±1%; Power(Watts): 100mW; Voltage-Supply(Max): 75V; Temperature Coefficient: ±100ppm/℃; Operating Temperature: -55℃~+155℃
R33 R34 = 0603WAF5100T5E: LCSC Part Name: 510Ω ±1% 100mW 厚膜电阻; Supplier Part: C23193; Manufacturer: UNI-ROYAL(厚声); Supplier Footprint: 0603; JLCPCB Part Class: 基础库; Datasheet: https://item.szlcsc.com/datasheet/0603WAF5100T5E/23920.html; Supplier: LCSC; Type: 厚膜电阻; Tolerance: ±1%; Power(Watts): 100mW; Voltage-Supply(Max): 75V; Temperature Coefficient: ±100ppm/℃; Operating Temperature: -55℃~+155℃
stlink = STM32F103CBT6: LCSC Part Name: 主流增强型ARM Cortex-M3 MCU，具有128 KB Flash、72 MHz CPU、电机控制、USB和CAN; Supplier Part: C8304; Manufacturer: ST(意法半导体); Supplier Footprint: LQFP-48(7x7); JLCPCB Part Class: 扩展库; Datasheet: https://item.szlcsc.com/datasheet/STM32F103CBT6/8796.html; Supplier: LCSC; CPU Core: ARM-M3; CPU Maximum Speed: 72MHz; Program Storage Size: 128KB; Program Memory Type: FLASH; Number of I/O: 37; ADC (Bit): 12bit; Voltage - Supply: 2V~3.6V
STLINK_SWD = IPCP254M04PB08V: LCSC Part Name: 1x4P 间距:2.54mm 方针 直插; Supplier Part: C22438419; Manufacturer: INCP; Supplier Footprint: 插件,P=2.54mm; JLCPCB Part Class: 扩展库; Datasheet: https://item.szlcsc.com/datasheet/IPCP254M04PB08V/24076608.html; Supplier: LCSC; Pin Structure: 1x4P; Pitch: 2.54mm; Circluar Pins/Square Pins: 方针; Mounting Type: 直插; Number of Rows: 单排; Number of Pins: 4P; Current Rating: 3A; Insulation Height: 2.5mm; Contact Material: 黄铜; Contact Plating: 金; Operating Temperature: -40℃~+105℃; Color: 黑色

## Nets
3V3: AMS1117.2(VOUT(TAB)) AMS1117.4(TAB) boothigh空.2 C24.1 Cams3v3.1 Cmpu1.2 Cmpu2.2 Cst_vg1.1 Cst_vg2.1 Cst_vg3.1 Cst_vg4.1 Cvdd1.2 Cvdd2.2 Cvdd3.2 Cvdd4.2 Cvdd5.2 Cvdd6.2 Cvdd7.2 Cvdd8.1 MPU.8(VLOGIC) MPU.13(VDD) oled.2 Q1.3(C) R1.1 R6.1 R12.2 R13.2 R17.1 R18.1 R22.2 R30.1 R31.1 st_blue.2(A) stlink.1(VBAT) stlink.9(VDD_A) stlink.24(VDD_1) stlink.36(VDD_2) stlink.48(VDD_3) STLINK_SWD.1 stm32.1(VBAT) stm32.9(VDDA) stm32.24(VDD_1) stm32.36(VDD_2) stm32.48(VDD_3) SW1.1 SW2.1 SW3.1 SWD.4
5V_IN: POWER.A4(VBUS) POWER.A9(VBUS) POWER.B4(VBUS) POWER.B9(VBUS) POWER_SELECT.2
6V: C29.2 D5.1(K) Motor.5 R15.2
+5V: AMS1117.3(VIN) ASRPRO.15(5V) Cams5v.1 Cip5306out1.1 Cip5306out2.1 Cip5306out3.1 Cip5306out4.1 Cmt3608.2 DHT.1 F1.2 IP5306.8(VOUT) L2.2 Motor_L.5 Motor_R.5 MT3608.4(EN) MT3608.5(IN) POWER_SELECT.1 R28.2 VCP.2(VBUS) VCP.11(VBUS) VCP_micro.1(VBUS)
GND: AMS1117.1(ADJ(GND)) ASRPRO.2(GND) ASRPRO.16(GND) BATTERY.1 C12.1 C13.1 C16.1 C22.1 C23.2 C24.2 C25.1 C27.1 C29.1 C30.1 C31.1 Cams3v3.2 Cams5v.2 Cip5306in.1 Cip5306out1.2 Cip5306out2.2 Cip5306out3.2 Cip5306out4.2 Cmpu1.1 Cmpu2.1 Cmt3608.1 Cnrst.2 Cst_nrst1.2 Cst_vg1.2 Cst_vg2.2 Cst_vg3.2 Cst_vg4.2 Cvdd1.1 Cvdd2.1 Cvdd3.1 Cvdd4.1 Cvdd5.1 Cvdd6.1 Cvdd7.1 Cvdd8.2 D6.2 DHT.3 IP5306.9(EP) Motor.6 Motor_L.2 Motor_R.2 MPU.1(CLKIN) MPU.11(FSYNC) MPU.18(GND) MPU.25(EP) MT3608.2(GND) oled.1 POWER.1(EH) POWER.A1(GND) POWER.A12(GND) POWER.B1(GND) POWER.B12(GND) POWER1.2(-) POWER_DISPLAY.1 R4.1 R5.1 R10.2 R11.1 R14.1 R16.1 R19.1 R20.1 R23.2 R24.2 R25.1 R27.1 R32.2 R35.1 R36.1 RESET.1 st_red.2(-) stlink.8(VSS_A) stlink.20(PB2BOOT1) stlink.23(VSS_1) stlink.35(VSS_2) stlink.47(VSS_3) STLINK_SWD.2 STLINKv2.1.1(EH) STLINKv2.1.A1(GND) STLINKv2.1.A12(GND) STLINKv2.1.B1(GND) STLINKv2.1.B12(GND) stm32.8(VSSA) stm32.23(VSS_1) stm32.35(VSS_2) stm32.47(VSS_3) SWD.3 usart1.3 usart3.3 VCP.1(GND) VCP.12(GND) VCP.13(SHELL) VCP.14(SHELL) VCP_micro.4(ID) VCP_micro.5(GND) VCP_micro.6(SH1) VCP_micro.7(SH2) VCP_micro.8(SH3) VCP_micro.9(SH4)
AIN: R31.2 R32.1 stlink.10(PA0_WKUPUSART2_CTSADC12_IN0TIM2_CH1_ETR)
ASRPRO_PA0: ASRPRO.4(PA0) stm32.18(PB0)
ASRPRO_PA1: ASRPRO.5(PA1) stm32.19(PB1)
ASRPRO_PA2: ASRPRO.12(PA2) stm32.12(PA2)
ASRPRO_PA3: ASRPRO.11(PA3) stm32.39(PB3)
BAT: BATTERY.2 C23.1 L1.2 R9.2
BOOT0: boothigh空.1 R4.2 stm32.44(BOOT0)
BOOT1: PB2LED.1(K) R5.2 stm32.20(PB2)
DHT_DAT: DHT.2 stm32.29(PA8)
ENCODER_LA: Motor_L.4 stm32.40(PB4)
ENCODER_LB: Motor_L.3 stm32.41(PB5)
ENCODER_RA: Motor_R.4 stm32.45(PB8)
ENCODER_RB: Motor_R.3 stm32.46(PB9)
IP5306_IN: Cip5306in.2 IP5306.1(VIN) POWER_SELECT.3 R8.2
L+: Motor_L.6 U6.2
L-: Motor_L.1 U6.1
L_PWM: Motor.2 stm32.10(PA0-WKUP)
L_TURN: Motor.1 stm32.13(PA3)
NRST: Cnrst.1 R1.2 RESET.2 stlink.18(PB0ADC12_IN8TIM3_CH3) stm32.7(NRST)
OLED_CS: oled.7 stm32.27(PB14)
OLED_DC: oled.6 stm32.26(PB13)
OLED_RES: oled.5 stm32.25(PB12)
OSC32_IN: stm32.3(PC14-OSC32_IN)
OSC32_OUT: stm32.4(PC15-OSC32_OUT)
OSC_IN: C12.2 stm32.5(PD0-OSC_IN) X1.1(OSC1)
OSC_OUT: C13.2 stm32.6(PD1-OSC_OUT) X1.2(OSC2)
PA1: Motor.4 stm32.11(PA1)
PA4: stm32.14(PA4) SW1.2
PA5: oled.3 stm32.15(PA5)
PA6: stm32.16(PA6) SW2.2
PA7: oled.4 stm32.17(PA7)
PA9: stlink.13(PA3USART2_RXADC12_IN3TIM2_CH4) stm32.30(PA9) usart1.1
PA10: stlink.12(PA2USART2_TXADC12_IN2TIM2_CH3) stm32.31(PA10) usart1.2
PA11: stm32.32(PA11) VCP.5(DN2) VCP.7(DN1) VCP_micro.2(D-)
PA12: stm32.33(PA12) VCP.6(DP1) VCP.8(DP2) VCP_micro.3(D+)
PA13: R21.2 stlink.27(PB14SPI2_MISOUSART3_RTSTIM1_CH2N) stm32.34(PA13) SWD.2
PA14: stlink.15(PA5SPI1_SCKADC12_IN5) stlink.26(PB13SPI2_SCKUSART3_CTSTIM1_CH1N) stm32.37(PA14) SWD.1
PA15: Motor.3 stm32.38(PA15)
PB6: IIC空.1 MPU.23(SCL) R12.1 stm32.42(PB6)
PB7: IIC空.2 MPU.24(SDA) R13.1 stm32.43(PB7)
PB10: stm32.21(PB10) usart3.1
PB11: stm32.22(PB11) usart3.2
PB15: stm32.28(PB15) SW3.2
PC13: PC13LED.1(K) stm32.2(PC13-TAMPER-RTC)
R+: Motor_R.6 U7.2
R-: Motor_R.1 U7.1
ST_USB+: R26.2 stlink.33(PA12USART1_RTSCAN_TXTIM1_ETRUSBDP) STLINKv2.1.A6(D+) STLINKv2.1.B6(D+)
ST_USB-: stlink.32(PA11USART1_CTSCAN_RXTIM1_CH4USBDM) STLINKv2.1.A7(D-) STLINKv2.1.B7(D-)
STLINK_LED: R33.1 R34.1 stlink.30(PA9USART1_TXTIM1_CH2)
STLINK_NRST: Cst_nrst1.1 R30.2 stlink.7(NRST)
STLINK_SWCLK: stlink.37(PA14JTCKSWCLK) STLINK_SWD.4
STLINK_SWDIO: stlink.34(PA13JTMSSWDIO) STLINK_SWD.3
USB_RENUMN: R29.2 stlink.38(PA15JTDI)
$1N940: POWER.B5(CC2) R11.2
$1N945: POWER.A5(CC1) R10.1
$1N1477: MPU.9(AD0) R14.2
$1N1848: C25.2 MPU.10(REGOUT)
$1N1890: C27.2 MPU.20(CPOUT)
$1N5535: D5.2(A) L2.1 MT3608.1(SW)
$1N5567: MT3608.3(FB) R15.1 R16.2
$2N1682: R35.2 VCP.4(CC1)
$2N1703: R36.2 VCP.10(CC2)
$2N4715: IP5306.5(KEY) R7.2
$2N4720: POWER_DISPLAY.2 R7.1
$2N4867: C16.2 R8.1
$2N5169: D1.2(A) D2.1(C) IP5306.2(LED1)
$2N5174: D1.1(C) D2.2(A) D3.1(C) D4.2(A) IP5306.4(LED3)
$2N5218: D3.2(A) D4.1(C) IP5306.3(LED2)
$2N5524: IP5306.7(SW) L1.1
$2N5554: C22.2 IP5306.6(BAT) R9.1
$2N9914: POWER1.1(+) R6.2
$2N9917: PB2LED.2(A) R18.2
$2N9920: PC13LED.2(A) R17.2
$3N635: C30.2 stlink.5(PD0-OSC_IN) X2.1(OSC1)
$3N637: C31.2 stlink.6(PD1-OSC_OUT) X2.2(OSC2)
$3N644: R19.2 stlink.2(PC13-TAMPER-RTC)
$3N649: R20.2 stlink.3(PC14-OSC32_IN)
$3N1080: R21.1 stlink.25(PB12SPI2_NSSI2C2_SMBAUSART3_CKTIM1_BKIN)
$3N1266: R22.1 stlink.39(PB3JTDO)
$3N1347: R23.1 stlink.44(BOOT0)
$3N1748: D6.1 F1.1 STLINKv2.1.A4(VBUS) STLINKv2.1.A9(VBUS) STLINKv2.1.B4(VBUS) STLINKv2.1.B9(VBUS)
$3N1993: R24.1 STLINKv2.1.A5(CC1)
$3N1997: R25.2 STLINKv2.1.B5(CC2)
$3N2380: Q1.2(E) R26.1
$3N2705: Q1.1(B) R27.2 R28.1 R29.1
$3N3720: R33.2 st_blue.1(K)
$3N3725: R34.2 st_red.1(+)

Not connected (* = marked no-connect by the designer): ASRPRO 1(PA4) 3(3V3) 6(PC4) 7(SPK-) 8(SPK+) 9(PA6) 10(PA5) 13(PB6) 14(PB5); Motor 7* 8*; MPU 2(NC)* 3(NC)* 4(NC)* 5(NC)* 6(AUX_DA)* 7(AUX_CL)* 12(INT)* 14(NC)* 15(NC)* 16(NC)* 17(NC)* 19(RESV)* 21(RESV)* 22(RESV)*; MT3608 6(NC)*; POWER A6(D+)* A7(D-)* A8(SBU1)* B6(D+)* B7(D-)* B8(SBU2)*; stlink 4(PC15-OSC32_OUT) 11(PA1USART2_RTSADC12_IN1TIM2_CH2) 14(PA4SPI1_NSSUSART2_CKADC12_IN4) 16(PA6SPI1_MISOADC12_IN6TIM3_CH1) 17(PA7SPI1_MOSIADC12_IN7TIM3_CH2) 19(PB1ADC12_IN9TIM3_CH4) 21(PB10I2C2_SCLUSART3_TX) 22(PB11I2C2_SDAUSART3_RX-) 28(PB15SPI2_MOSITIM1_CH3N) 29(PA8USART1_CKTIM1_CH1MCO) 31(PA10USART1_RXTIM1_CH3) 40(PB4NJTRST) 41(PB5I2C1_SMBA) 42(PB6I2C1_SCLTIM4_CH1) 43(PB7I2C1_SDATIM4_CH2) 45(PB8TIM4_CH3) 46(PB9TIM4_CH4); STLINKv2.1 A8(SBU1)* B8(SBU2)*; VCP 3(SBU2) 9(SBU1)

## Notes on the sheets
sheet 1
- 供电Typec母口
- MPU6050
- 电机驱动接口
- 升压电路
sheet 2
- 复位电路
- 烧录口
- VCP_typec
- VCP_micro
- MCU
sheet 3
- STLINKV2.1
